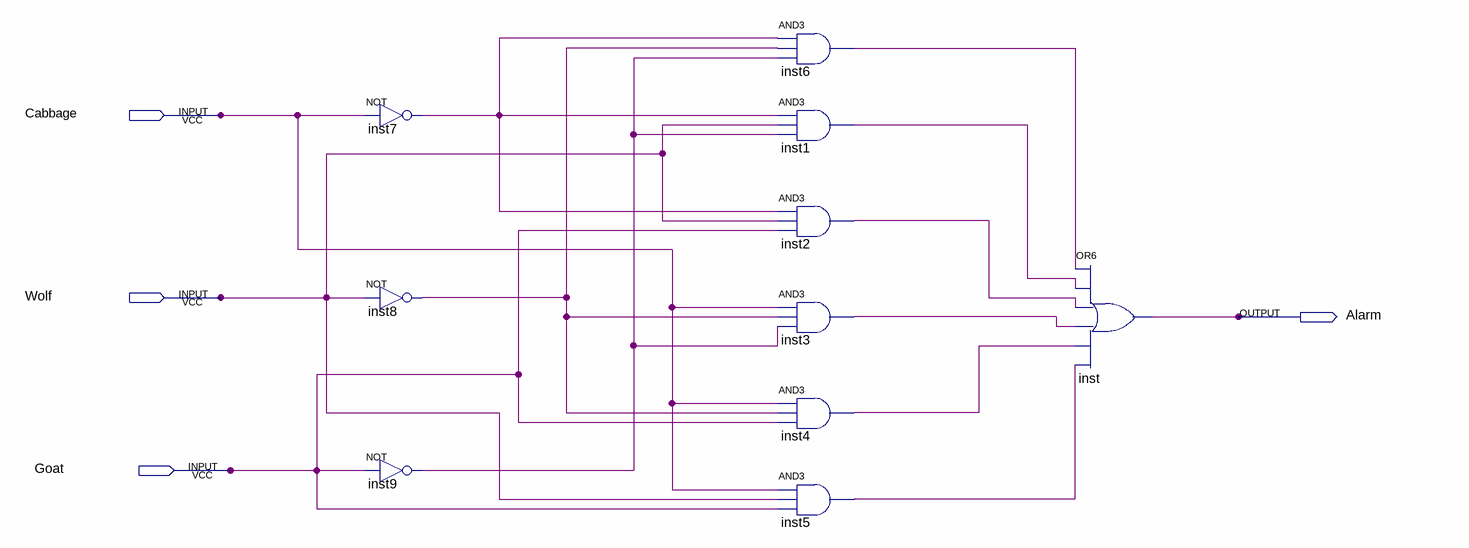
[diagram p0: schematic sheet]
// Quartus schematic lab2step2.bdf as structural Verilog: 10 symbols, 4 pins
module lab2step2 (
  input  Cabbage,
  input  Wolf,
  input  Goat,
  output Alarm
);

  wire inst1_out, inst2_out, inst3_out, inst4_out, inst5_out, inst6_out, inst7_out, inst8_out, inst9_out;

  not inst7 (inst7_out, Cabbage);
  not inst8 (inst8_out, Wolf);
  not inst9 (inst9_out, Goat);
  and inst6 (inst6_out, inst7_out, inst8_out, inst9_out);
  and inst1 (inst1_out, inst7_out, Wolf, inst9_out);
  and inst2 (inst2_out, inst7_out, Wolf, Goat);
  and inst3 (inst3_out, Cabbage, inst8_out, inst9_out);
  and inst4 (inst4_out, Cabbage, inst8_out, Goat);
  and inst5 (inst5_out, Cabbage, Wolf, Goat);
  or inst (Alarm, inst6_out, inst1_out, inst2_out, inst3_out, inst4_out, inst5_out);
endmodule
